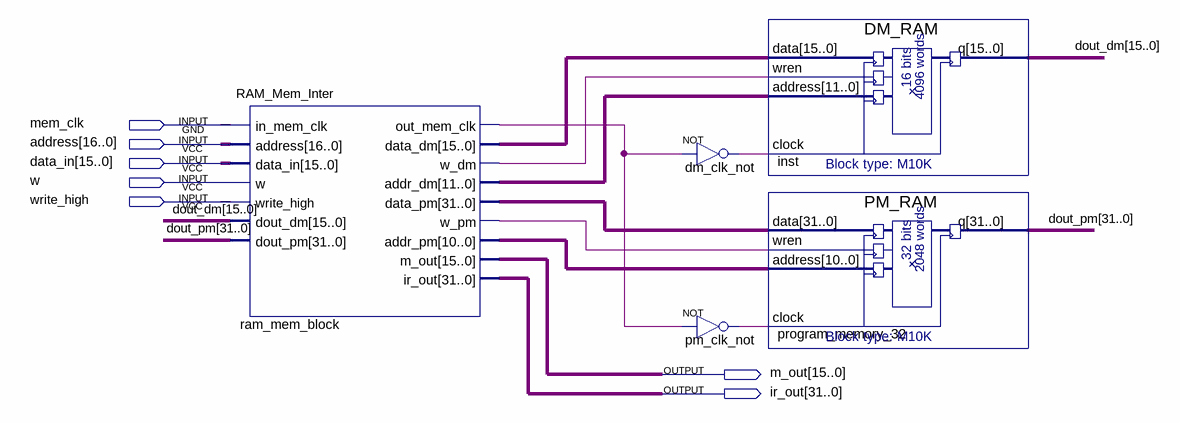
[diagram p0: schematic sheet]
// Quartus schematic RAM_Interface.bdf as structural Verilog: 5 symbols, 7 pins
module RAM_Interface (
  input  mem_clk,
  input  [16:0] address,
  input  [15:0] data_in,
  input  w,
  input  write_high,
  output [15:0] m_out,
  output [31:0] ir_out
);

  wire dm_clk_not_out, pm_clk_not_out, ram_mem_block_out_mem_clk, ram_mem_block_w_dm, ram_mem_block_w_pm;
  wire [10:0] ram_mem_block_addr_pm;
  wire [11:0] ram_mem_block_addr_dm;
  wire [15:0] dout_dm, ram_mem_block_data_dm;
  wire [31:0] dout_pm, ram_mem_block_data_pm;

  RAM_Mem_Inter ram_mem_block (
    .in_mem_clk(mem_clk), .address(address), .data_in(data_in), .w(w), .write_high(write_high),
    .dout_dm(dout_dm), .dout_pm(dout_pm), .out_mem_clk(ram_mem_block_out_mem_clk),
    .data_dm(ram_mem_block_data_dm), .w_dm(ram_mem_block_w_dm), .addr_dm(ram_mem_block_addr_dm),
    .data_pm(ram_mem_block_data_pm), .w_pm(ram_mem_block_w_pm), .addr_pm(ram_mem_block_addr_pm),
    .m_out(m_out), .ir_out(ir_out));
  not dm_clk_not (dm_clk_not_out, ram_mem_block_out_mem_clk);
  not pm_clk_not (pm_clk_not_out, ram_mem_block_out_mem_clk);
  DM_RAM inst (
    .data(ram_mem_block_data_dm), .wren(ram_mem_block_w_dm), .address(ram_mem_block_addr_dm),
    .clock(dm_clk_not_out), .q(dout_dm));
  PM_RAM program_memory_32 (
    .data(ram_mem_block_data_pm), .wren(ram_mem_block_w_pm), .address(ram_mem_block_addr_pm),
    .clock(pm_clk_not_out), .q(dout_pm));
endmodule
